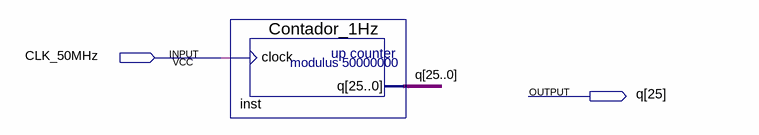
[diagram p0: schematic sheet]
// Quartus schematic Exercicio_2.bdf as structural Verilog: 1 symbols, 2 pins
module Exercicio_2 (
  input  CLK_50MHz,
  output [25:0] q
);

  Contador_1Hz inst (.clock(CLK_50MHz), .q(q));
endmodule
